# EAGLE schematic test (EAGLE 8.2.0)
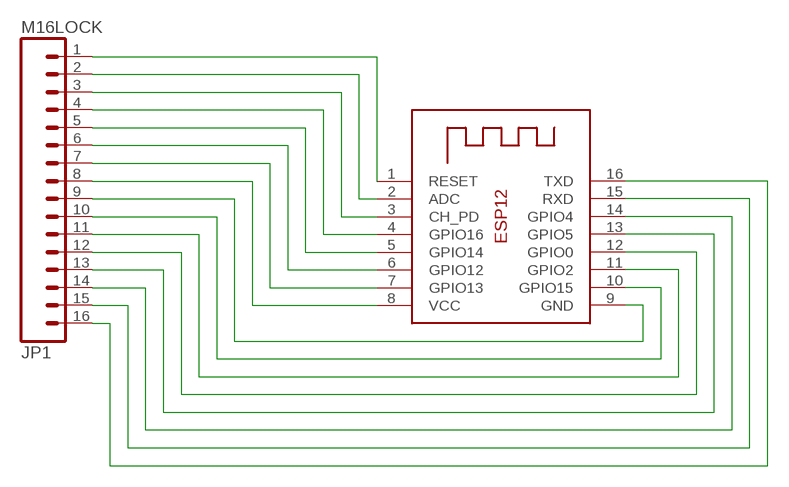
[diagram p0: schematic, sheet 1]

## Parts
JP1  M16LOCK  [1X16_LOCK]
X1  ESP-12  [ESP-12]

## Nets
N$1: JP1.1 X1.1(RESET)
N$2: JP1.2 X1.2(ADC)
N$3: JP1.3 X1.3(CH_PD)
N$4: JP1.4 X1.4(GPIO16)
N$5: JP1.5 X1.5(GPIO14)
N$6: JP1.6 X1.6(GPIO12)
N$7: JP1.7 X1.7(GPIO13)
N$8: JP1.8 X1.8(VCC)
N$9: JP1.9 X1.9(GND)
N$10: JP1.10 X1.10(GPIO15)
N$11: JP1.11 X1.11(GPIO2)
N$12: JP1.12 X1.12(GPIO0)
N$13: JP1.13 X1.13(GPIO5)
N$14: JP1.14 X1.14(GPIO4)
N$15: JP1.15 X1.15(RXD)
N$16: JP1.16 X1.16(TXD)

## Library data of the parts
JP1 = Mawrey:M16
X1 = adafruit:ESP-12

## Net classes
0 default: width 0.254 mm, drill 0.508 mm, clearance 0.254 mm